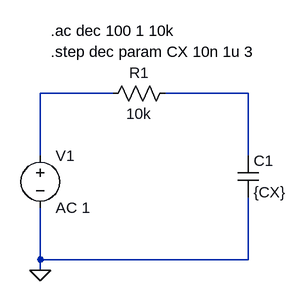
[diagram p0: schematic ac_sweep_step_cx.asc]
ac_sweep_step_cx.asc, the LTspice schematic file:
Version 4
SHEET 1 880 680
WIRE -144 0 -256 0
WIRE 64 0 -64 0
WIRE -256 96 -256 0
WIRE 64 96 64 0
WIRE -256 256 -256 176
WIRE 64 256 64 160
WIRE 64 256 -256 256
WIRE -256 272 -256 256
FLAG -256 272 0
SYMBOL voltage -256 80 R0
SYMATTR InstName V1
SYMATTR Value AC 1
SYMBOL res -160 16 R270
WINDOW 0 32 56 VTop 0
WINDOW 3 0 56 VBottom 0
SYMATTR InstName R1
SYMATTR Value 10k
SYMBOL cap 48 96 R0
SYMATTR InstName C1
SYMATTR Value {CX}
TEXT -240 -96 Left 0 !.ac dec 100 1 10k
TEXT -240 -64 Left 0 !.step dec param CX 10n 1u 3

The netlist it stands for:
* ac_sweep_step_cx.asc
V1 N001 0 AC 1
R1 N001 N002 10k
C1 N002 0 {CX}
.ac dec 100 1 10k
.step dec param CX 10n 1u 3
.backanno
.end